# EAGLE schematic attiny24-mini-1-1 (EAGLE 5.10)
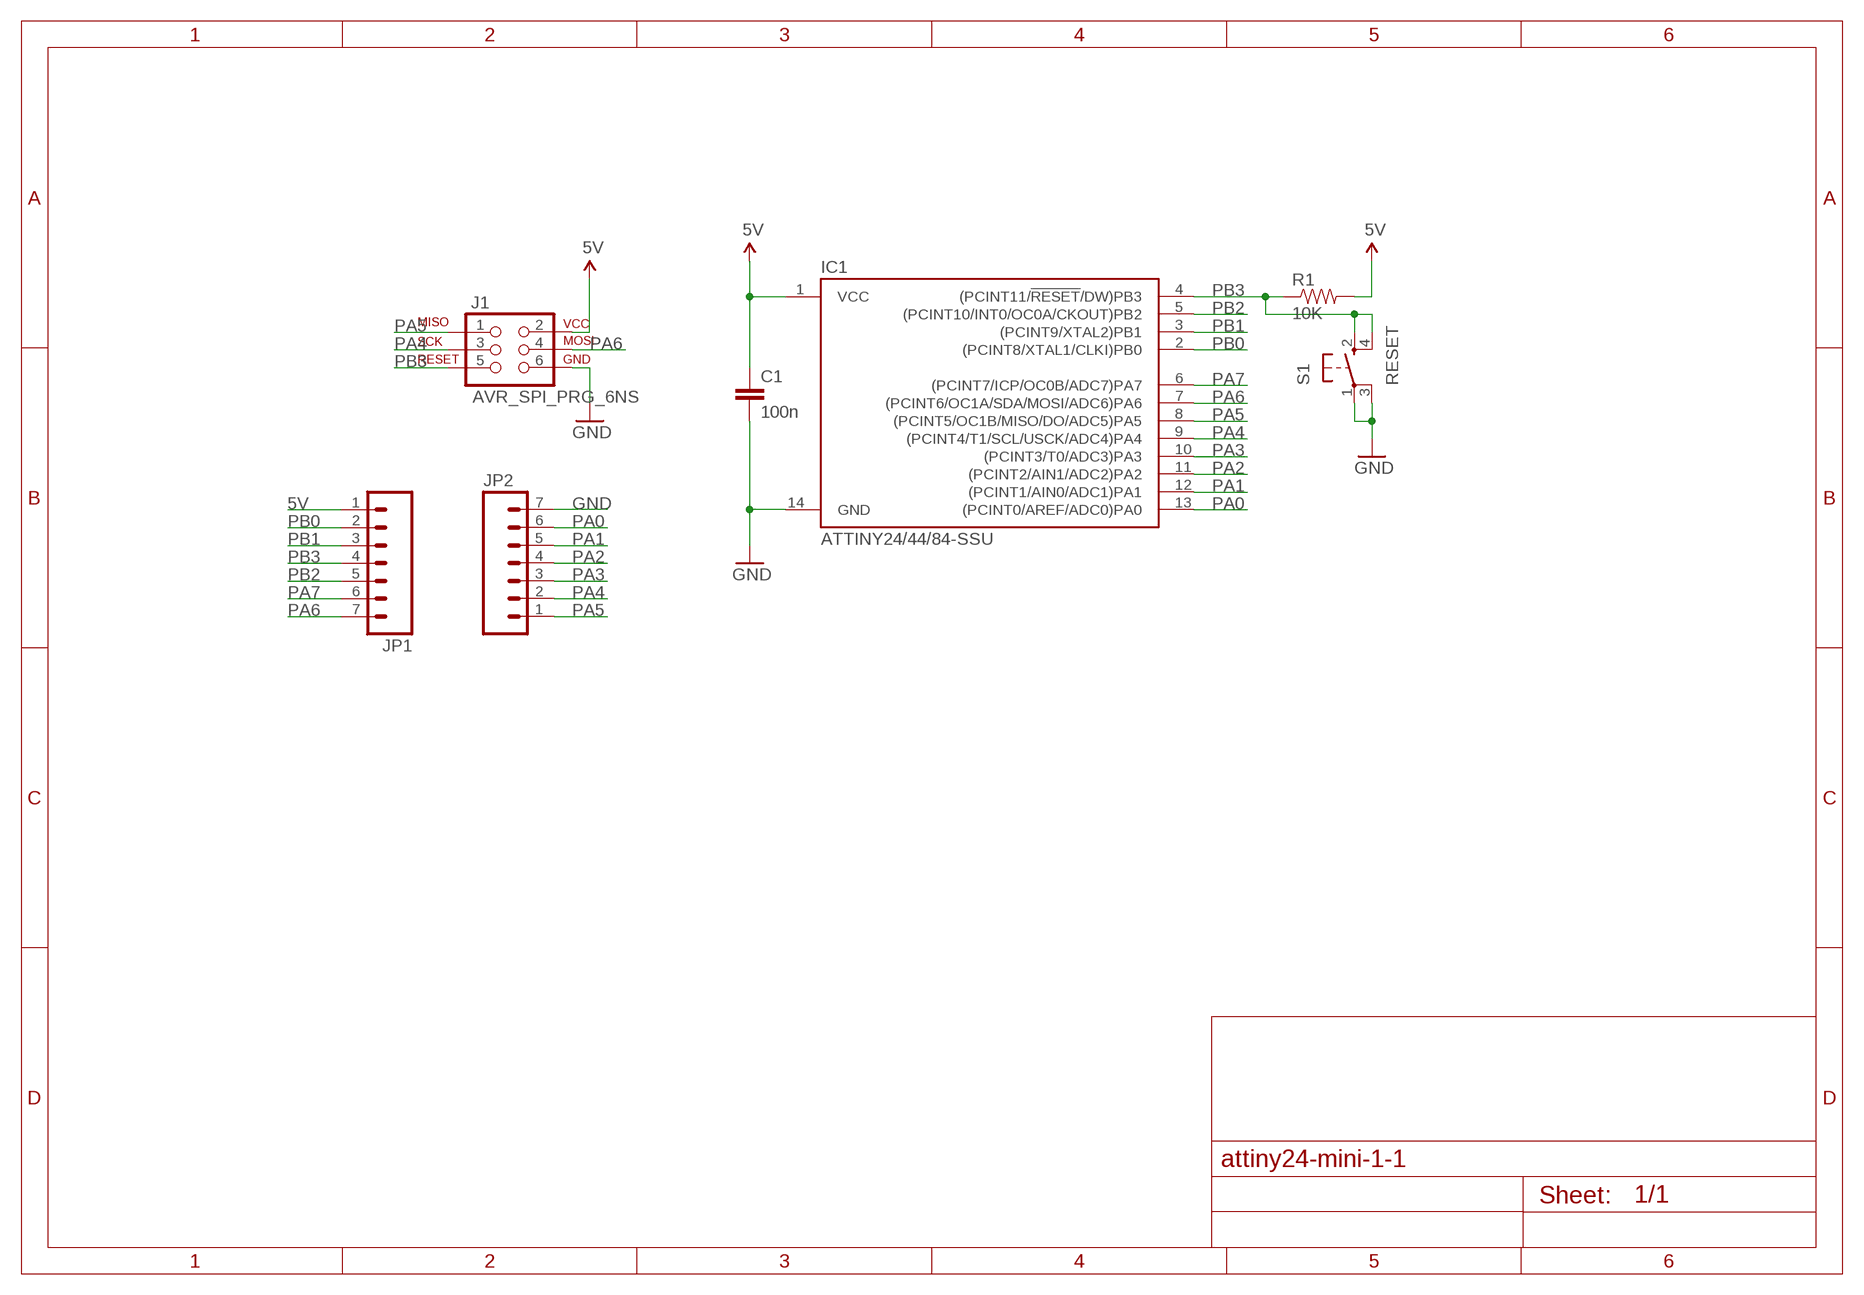
[diagram p0: schematic, sheet 1]

## Parts
C1  100n  CAP0805  [0805]
IC1  ATTINY24/44/84-SSU  [AVR-SOIC14]
J1  AVR_SPI_PRG_6NS  [2X3-NS]
JP1  M07  [1X07]
JP2  M07  [1X07]
R1  10K  RESISTOR0805  [0805]
S1  RESET  SWITCH-TACT_SFKHHM  [SWITCH-TACT_SFKHHM]

## Nets
5V [power]: C1.1 IC1.1(VCC) J1.2 JP1.1 R1.2
GND: C1.2 IC1.14(GND) J1.6 JP2.7 S1.1 S1.3
PA0: IC1.13((PCINT0/AREF/ADC0)PA0) JP2.6
PA1: IC1.12((PCINT1/AIN0/ADC1)PA1) JP2.5
PA2: IC1.11((PCINT2/AIN1/ADC2)PA2) JP2.4
PA3: IC1.10((PCINT3/T0/ADC3)PA3) JP2.3
PA4: IC1.9((PCINT4/T1/SCL/USCK/ADC4)PA4) J1.3 JP2.2
PA5: IC1.8((PCINT5/OC1B/MISO/DO/ADC5)PA5) J1.1 JP2.1
PA6: IC1.7((PCINT6/OC1A/SDA/MOSI/ADC6)PA6) J1.4 JP1.7
PA7: IC1.6((PCINT7/ICP/OC0B/ADC7)PA7) JP1.6
PB0: IC1.2((PCINT8/XTAL1/CLKI)PB0) JP1.2
PB1: IC1.3((PCINT9/XTAL2)PB1) JP1.3
PB2: IC1.5((PCINT10/INT0/OC0A/CKOUT)PB2) JP1.5
PB3: IC1.4((PCINT11/!RESET!/DW)PB3) J1.5 JP1.4 R1.1 S1.2 S1.4

## Library data of the parts
C1 = attiny24:CAP: Capacitor Standard 0603 ceramic capacitor, and 0.1" leaded capacitor.
IC1 = attiny24:ATTINY24/44/84
J1 = attiny24:AVR_SPI_PRG_6: AVR ISP 6 Pin This is the reduced ISP connector for AVR programming. Common on Arduino. This footprint will take up less PCB space and can be used with a 10-pin to 6-pin adapter such as SKU: BOB-08508
JP1 JP2 = attiny24:M07: Header 7 Standard 7-pin 0.1" header. Use with straight break away headers (SKU : PRT-00116), right angle break away headers (PRT-00553), swiss pins (PRT-00743), machine pins (PRT-00117), and female headers (PRT-00115). NOTES ON THE VARIANTS LOCK and LOCK_LONGPADS... This footprint was designed to help hold the alignment of a through-hole component (i.e. 7-pin header) while soldering it into place. You may notice that each hole has been shifted either up or down by 0.005 of an inch from it's more standard position (which is usually a perfectly straight line). This slight alteration caused the pins (the squares in the middle) to touch the edges of the holes. Because they are alternating, it causes a "brace" to hold the header in place. 0.005 has proven to be the perfect amount of "off-center" position when using our standard breakaway headers. Although looks a little odd when you look at the bare footprint, once you have a header in there, the alteration is very hard to notice. Also, if you push a header all the way into place, it is covered up entirely on the bottom side. This idea of altering the position of holes to aid alignment will be further integrated into the Sparkfun Library for other footprints. It can help hold any component with 3 or more connection pins.
R1 = attiny24:RESISTOR: Resistor Basic schematic elements and footprints for 0402, 0603, 0805, 1206, PTH 1/10th watt (small), 0102, 0204, and etc. resistors.
S1 = attiny24:SWITCH-TACT_SFKHHM: Tact Switch made by Forward, Taiwan. Model No. Prefix SFKHHM

## Net classes
0 default: width 0.305 mm, drill 0.61 mm, clearance 0.203 mm
1 power: width 0.406 mm, drill 0.813 mm, clearance 0.203 mm